# Altium schematic sheet ESP32WROOM_Sheet.SchDoc: ESP32-WROOM-32
size 381 x 241 mm; DocumentNumber: 1; Revision: 1.0; SheetNumber: 1; SheetTotal: 5
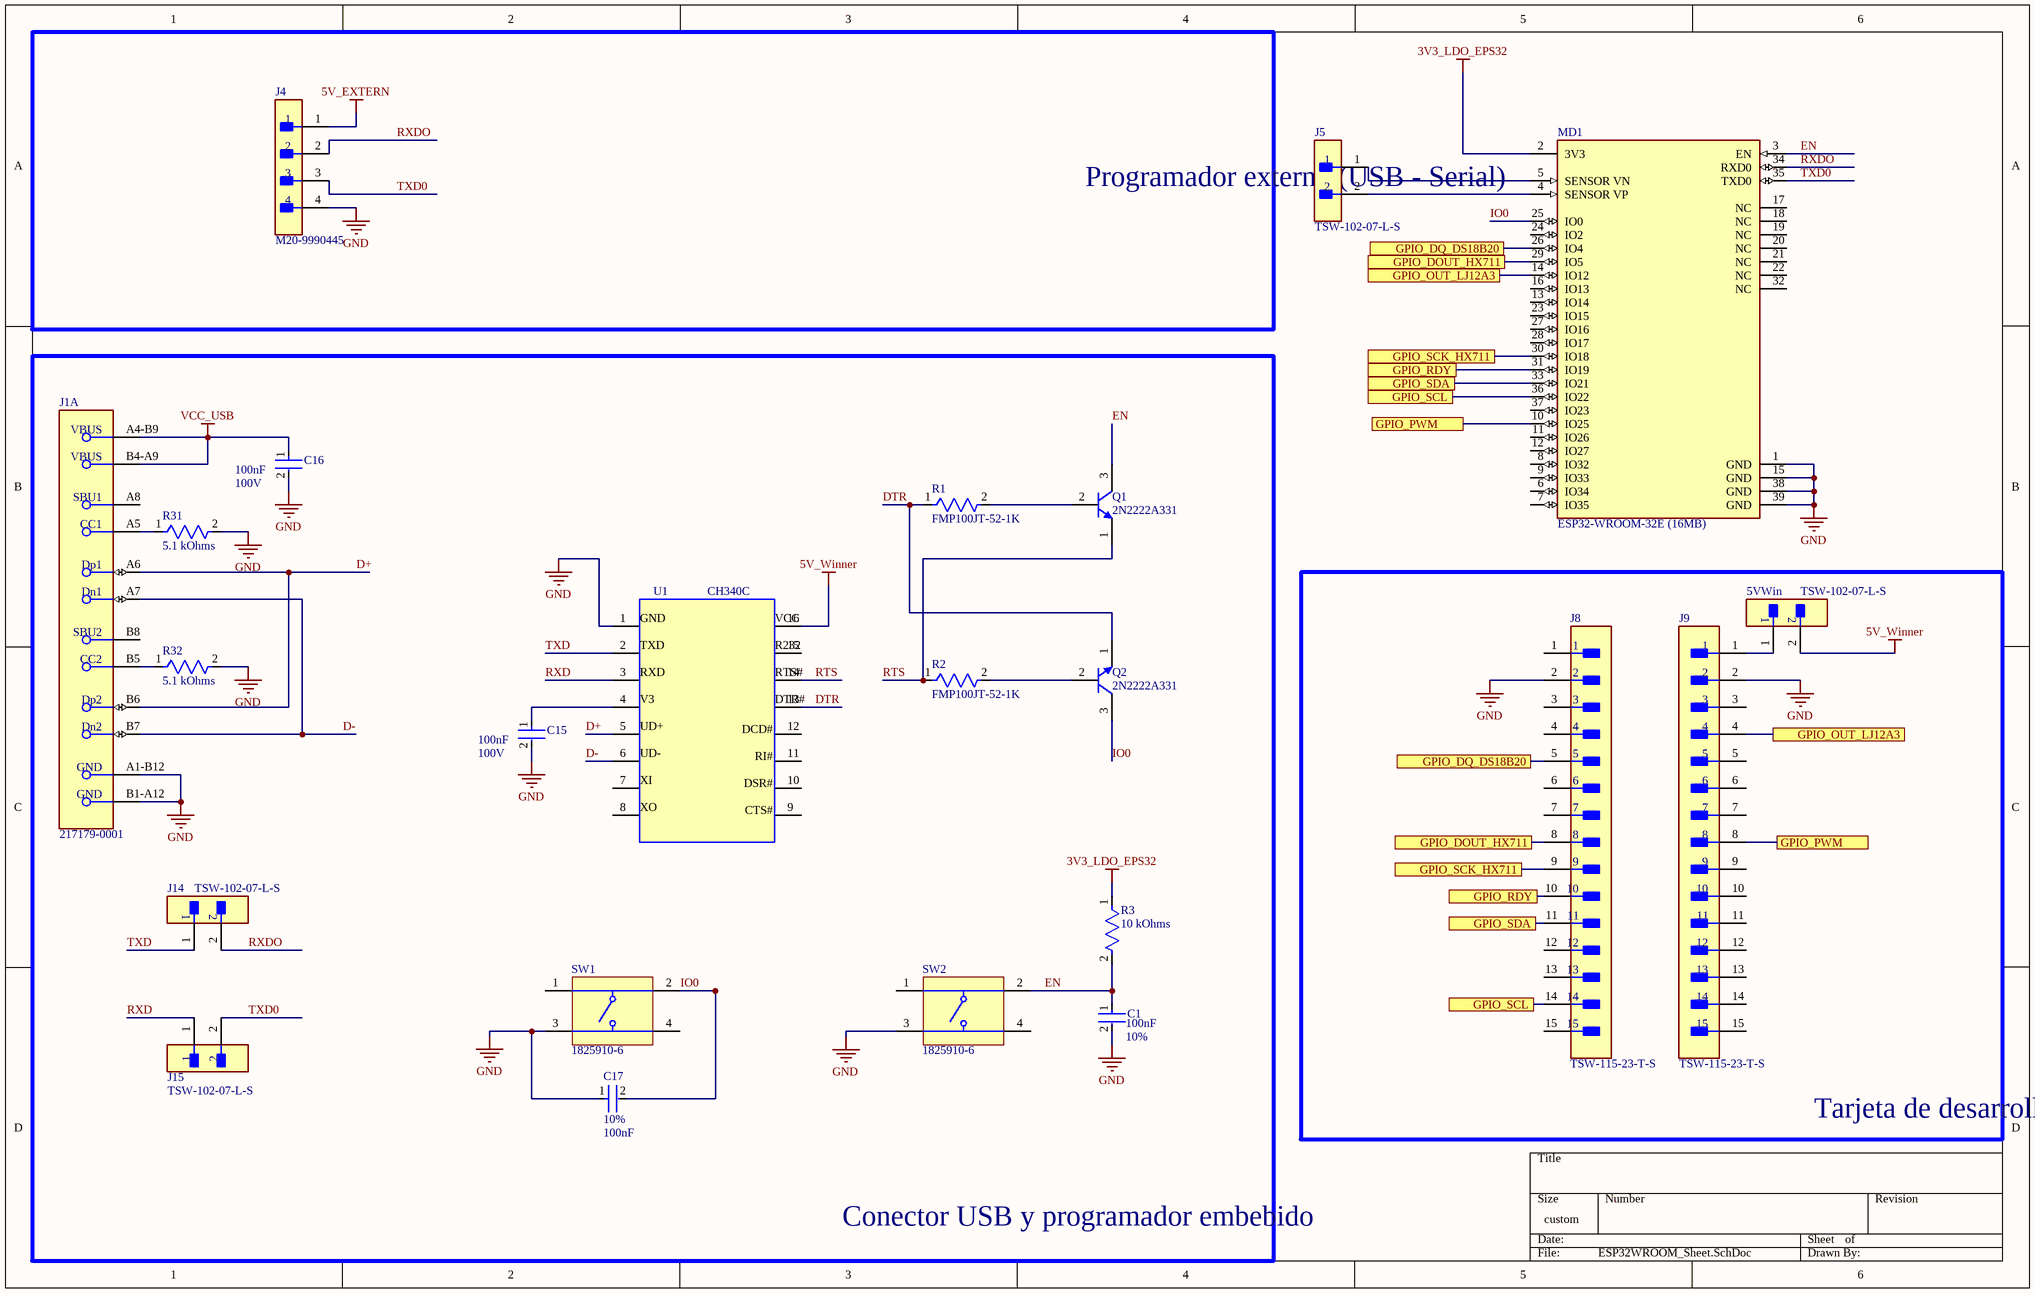
[diagram p0: ESP32WROOM_Sheet.SchDoc]

## Parts
5VWin  TSW-102-07-L-S  [FP-TSW-102-07-L-S-MFG]
C1  Tolerance: 10%  Capacitance: 100nF  [FP-RDE2M1-MFG]  (hidden comment: RDER72E104K2K1H03B)
C15  Capacitance: 100nF  Voltage Rating (DC): 100V  [FP-RCE1K1-2_5-MFG]  (hidden comment: RCER72A104K1K1H03B)
C16  Capacitance: 100nF  Voltage Rating (DC): 100V  [FP-RCE1K1-2_5-MFG]  (hidden comment: RCER72A104K1K1H03B)
C17  Tolerance: 10%  Capacitance: 100nF  [FP-RDE2M1-MFG]  (hidden comment: RDER72E104K2K1H03B)
J1  217179-0001  [FP-2171790001-MFG]  (part A of 2)
J4  M20-9990445  [FP-M20-9990445-MFG]
J5  TSW-102-07-L-S  [FP-TSW-102-07-L-S-MFG]
J8  TSW-115-23-T-S  [FP-TSW-115-23-T-S-MFG]
J9  TSW-115-23-T-S  [FP-TSW-115-23-T-S-MFG]
J14  TSW-102-07-L-S  [FP-TSW-102-07-L-S-MFG]
J15  TSW-102-07-L-S  [FP-TSW-102-07-L-S-MFG]
MD1  ESP32-WROOM-32E (16MB)  [FP-ESP32-WROOM-32E_16MB-MFG]
Q1  2N2222A331  [TO-92]
Q2  2N2222A331  [TO-92]
R1  FMP100JT-52-1K  [FP-FMP100-MFG]
R2  FMP100JT-52-1K  [FP-FMP100-MFG]
R3  10 kOhms  [FP-FMP100-MFG]
R31  5.1 kOhms  [FP-FMP100-MFG]
R32  5.1 kOhms  [FP-FMP100-MFG]
SW1  1825910-6  [TECO-1825910-6_V]
SW2  1825910-6  [TECO-1825910-6_V]
U1  CH340C  [SOP-16 (SOP127P780X190-16N)]

## Blocks framed on the sheet
Programador externo (USB - Serial): J4
Conector USB y programador embebido: C1 C15-C17 J1 J14 J15 Q1 Q2 R1-R3 R31 R32 SW1 SW2 U1
Tarjeta de desarrollo externa: 5VWin J8 J9

## Ports
GPIO_DOUT_HX711 (see ESP32WROOM_Sheet[5A], Sensores_ADCs_Sheet[3C]), GPIO_DOUT_HX711 (see ESP32WROOM_Sheet[5C], Sensores_ADCs_Sheet[3C]), GPIO_DQ_DS18B20 (see ESP32WROOM_Sheet[5A], Sensores_ADCs_Sheet[4B]), GPIO_DQ_DS18B20 (see ESP32WROOM_Sheet[5C], Sensores_ADCs_Sheet[4B]), GPIO_OUT_LJ12A3 (see ESP32WROOM_Sheet[5A], Sensores_ADCs_Sheet[5B]), GPIO_OUT_LJ12A3 (see ESP32WROOM_Sheet[6C], Sensores_ADCs_Sheet[5B]), GPIO_PWM (see Driver_Motor_Sheet[1C], ESP32WROOM_Sheet[5B]), GPIO_PWM (see Driver_Motor_Sheet[1C], ESP32WROOM_Sheet[6C]), GPIO_RDY (see ESP32WROOM_Sheet[5B], Sensores_ADCs_Sheet[4B]), GPIO_RDY (see ESP32WROOM_Sheet[5C], Sensores_ADCs_Sheet[4B]), GPIO_SCK_HX711 (see ESP32WROOM_Sheet[5B], Sensores_ADCs_Sheet[3C]), GPIO_SCK_HX711 (see ESP32WROOM_Sheet[5C], Sensores_ADCs_Sheet[3C]), GPIO_SCL (see ESP32WROOM_Sheet[5B], Sensores_ADCs_Sheet[4A]), GPIO_SCL (see ESP32WROOM_Sheet[5D], Sensores_ADCs_Sheet[4A]), GPIO_SDA (see ESP32WROOM_Sheet[5B], Sensores_ADCs_Sheet[4A]), GPIO_SDA (see ESP32WROOM_Sheet[5C], Sensores_ADCs_Sheet[4A])

## Nets
3V3_LDO_EPS32: MD1.2(3V3) R3.1
5V_EXTERN: J4.1
5V_Winner: 5VWin.2 U1.16
GND: C1.2 C15.2 C16.2 C17.1 J1.A1-B12(GND) J1.B1-A12(GND) J4.4 J8.2 J9.2 MD1.1(GND) MD1.15(GND) MD1.38(GND) MD1.39(GND) R31.2 R32.2 SW1.3 SW2.3 U1.1
VCC_USB: C16.1 J1.A4-B9(VBUS) J1.B4-A9(VBUS)
D+: J1.A6(Dp1) J1.B6(Dp2) U1.5
D-: J1.A7(Dn1) J1.B7(Dn2) U1.6
DTR: Q2.1(E) R1.1 U1.13
EN: C1.1 MD1.3(EN) Q1.3(C) R3.2 SW2.2
GPIO_DOUT_HX711: J8.8 MD1.29(IO5) ; port GPIO_DOUT_HX711
GPIO_DQ_DS18B20: J8.5 MD1.26(IO4) ; port GPIO_DQ_DS18B20
GPIO_OUT_LJ12A3: J9.4 MD1.14(IO12) ; port GPIO_OUT_LJ12A3
GPIO_PWM: J9.8 MD1.10(IO25) ; port GPIO_PWM
GPIO_RDY: J8.10 MD1.31(IO19) ; port GPIO_RDY
GPIO_SCK_HX711: J8.9 MD1.30(IO18) ; port GPIO_SCK_HX711
GPIO_SCL: J8.14 MD1.36(IO22) ; port GPIO_SCL
GPIO_SDA: J8.11 MD1.33(IO21) ; port GPIO_SDA
IO0: C17.2 MD1.25(IO0) Q2.3(C) SW1.2
RTS: Q1.1(E) R2.1 U1.14
RXD: J15.1 U1.3
RXDO: J4.2 J14.2 MD1.34(RXD0)
TXD: J14.1 U1.2
TXD0: J4.3 J15.2 MD1.35(TXD0)
Net5VWin_1: 5VWin.1 J9.1
NetC15_1: C15.1 U1.4
NetJ1_A5: J1.A5(CC1) R31.1
NetJ1_B5: J1.B5(CC2) R32.1
NetJ5_1: J5.1 MD1.5(SENSOR_VN)
NetJ5_2: J5.2 MD1.4(SENSOR_VP)
NetQ1_2: Q1.2(B) R1.2
NetQ2_2: Q2.2(B) R2.2

Not connected (* = marked no-connect by the designer): J1 A8(SBU1) B8(SBU2); J8 1 3 4 6 7 12 13 15; J9 3 5 6 7 9 10 11 12 13 14 15; MD1 6(IO34) 7(IO35) 8(IO32) 9(IO33) 11(IO26) 12(IO27) 13(IO14) 16(IO13) 17(NC) 18(NC) 19(NC) 20(NC) 21(NC) 22(NC) 23(IO15) 24(IO2) 27(IO16) 28(IO17) 32(NC) 37(IO23); SW1 1 4; SW2 1 4; U1 7 8 9 10 11 12 15

## Notes on the sheet
- (in symbol CH340) GND; VCC; TXD; R232; RXD; RTS#; V3; DTR#; DCD#; UD+; RI#; UD-; DSR#; XI; CTS#; XO

## Library data of the parts
5VWin J5 J14 J15 = CMP-02766-001428-1: CONN HEADER VERT 2POS 2.54MM; Voltage Rating: 550V; Current Rating: 7.6A; Gender: Male; Number of Contacts: 2; Connector Type: Male Pin; Radiation Hardening: No; Orientation: Straight; Contact Plating: Gold; Max Operating Temperature: 125°C; Mount: Through Hole; Package Quantity: 1; Number of Rows: 1; Housing Material: Polyester; RoHS Compliant: Yes; Length: 5.08mm; Max Voltage Rating (AC): 550V; Pitch: 2.54mm; Packaging: Bulk; Depth: 2.54mm; Termination: Solder; Min Operating Temperature: -55°C; Housing Color: Black; Lead Free: Lead Free; Color: Black; Number of Positions: 2; Width: 2.54mm; Max Current Rating: 7.6A; REACH SVHC: No SVHC; Contact Material: Bronze; Contact Mating Length: 0.23inch; Series: TSW; Contact Type: Male Pin
C1 C17 = CMP-06035-020184-1: Ceramic Capacitor 100nF ±10% 250V X7R Radial; Lead/Base Style: Kinked; Lead Diameter: 0.5mm; Lead Pitch: 0.197inch; Dielectric: X7R; Mount: Through Hole; Resistor Type: Ceramic; Height: 4mm; Width: 0.124inch; Length: 5.5mm; Case/Package: Radial; Packaging: Bulk; Max Operating Temperature: 125°C; Voltage Rating (DC): 250V; Package Quantity: 500; Min Operating Temperature: -55°C; Voltage Rating: 250V; Termination: Radial; Height - Seated (Max): 0.236inch; Lead Free: Lead Free
C15 C16 = CMP-06035-011084-1: Cap Ceramic Monolithic 100nF 100V 10% Thru-Hole Bulk; Dielectric: X7R; Lead/Base Style: Formed Leads; Lead Diameter: 0.5mm; Resistor Type: Ceramic; Voltage Rating: 100V; Case/Package: Radial; Packaging: Bulk; Lead Pitch: 0.197inch; Height - Seated (Max): 0.138inch; Mount: Through Hole; Height: 3.5mm; Width: 0.098inch; Termination: Radial; Tolerance: 10%; Min Operating Temperature: -55°C; Package Quantity: 500; Max Operating Temperature: 125°C; Length: 0.157inch; Ratings: AEC-Q200
J1 = CMP-04767-000028-2: CONN RCP USB2.0 TYP C 24P SMD RA; NexarPartId: 117190526; Gender: Receptacle; Number of Contacts: 16; Current Rating: 1.25A; Voltage Rating: 30V; Min Operating Temperature: -40°C; USB Standard: USB 2.0; Height: 3.36mm; Contact Material: Gold, Nickel; Max Operating Temperature: 85°C
J4 = CMP-00671-05399696-1: M20-9990445 Conn Unshrouded Header HDR 4 POS 2.54mm Solder ST Thru-Hole Bulk/Loose; Insulation Resistance: 10GΩ; Connector Type: Male Pin; Voltage Rating (DC): 750V; Max Current Rating: 3A; Contact Resistance: 25mΩ; Number of Contacts: 4; Gender: Male; Color: Black; Height: 2.54mm; Contact Material: Brass, Bronze, Gold, Nickel; Orientation: Straight; Width: 12.7mm; Mount: Through Hole; Pitch: 2.54mm; Lead Pitch: 2.54mm; RoHS: Compliant; Max Operating Temperature: 105°C; Case/Package: SIL; NexarPartId: 5399696; Depth: 2.54mm; Length: 10.16mm; Current Rating: 3A; Contact Plating: Gold; Radiation Hardening: No; Contact Mating Length: 6.096mm; Voltage Rating (AC): 750V; Termination: Solder; REACH SVHC: No SVHC; Weight: 45.359237g; Number of Rows: 1; Min Operating Temperature: -40°C; Housing Material: Nylon; Housing Color: Black; Number of Positions: 4; Number of Pins: 4
J8 J9 = CMP-02766-001466-1: CONN HEADER VERT 15POS 2.54MM; Connector Type: Male Pin; Number of Contacts: 15; Gender: Male; Pitch: 0.1inch; Termination: Solder; Packaging: Bulk; Lead Free: Lead Free; Housing Color: Black; Housing Material: Plastic; Color: Black; RoHS Compliant: Yes; Contact Type: Male Pin; Width: 2.54mm; Mount: Through Hole; Contact Material: Bronze; Number of Rows: 1; Radiation Hardening: No; Number of Positions: 15; Length: 38.1mm; REACH SVHC: No SVHC; Height: 2.54mm; Contact Plating: Tin; Series: TSW; Contact Mating Length: 0.23inch
MD1 = CMP-194065-000027-1: RX TXRX MOD WIFI TRACE ANT SMD
Q1 Q2 = 2N2222A331: Bipolar (Bjt) Single Transistor, Npn, 30 V, 500 Mw, 800 Ma, 100 Rohs Compliant: Yes |Multicomp Pro 2N2222; Body Material: Metal; Collector Emitter Breakdown Voltage: 30V; hFE Min: 30; Max Collector Current: 800mA; Max Power Dissipation: 500mW; Number of Elements: 1; Transition Frequency: 250MHz; Supplier: Newark; Supplier Part Number: 87K2254; Manufacturer: Multicomp; Manufacturer Part Number: 2N2222; RoHS: Compliant; Category: BJTs; Stock: 14638; Pricing: 1=0,685, 10=0,562, 50=0,429, 100=0,379, 500=0,361, 1000=0,311, 5000=0,286, 10000=0,274 (USD); Case/Package: TO-18; Collector Emitter Voltage (VCEO): 30V; Lifecycle Status: Production; Max Operating Temperature: 200°C; Pins: 3; Number of Terminals: 3; Polarity: NPN; Power Dissipation: 500mW; REACH SVHC: No; ComponentLink1URL: https://datasheet.octopart.com:443/2N2222-Multicomp-datasheet-632794.pdf?src-supplier=IHS; ComponentLink1Description: https://datasheet.octopart.com:443/2N2222-Multicomp-datasheet-632794.pdf?src-supplier=IHS; ComponentLink2URL: https://datasheet.octopart.com:443/2N2222-Multicomp-datasheet-12475390.pdf?src-supplier=Newark; ComponentLink2Description: https://datasheet.octopart.com:443/2N2222-Multicomp-datasheet-12475390.pdf?src-supplier=Newark
R1-R3 R31 R32 = CMP-00621-25629781-1: Resistor, 1 kOhm, ± 5%, 1 W, Axial Leaded, Metal Film, High Power Flame Proof; Power Rating: 1W; Resistance: 1kΩ; Temperature Coefficient: 100ppm/°C; Length: 6.3mm; Min Operating Temperature: -55°C; Tolerance: 5%; RoHS: Compliant; Military Standard: Not; Mount: Through Hole; Case/Package: Conformal; Diameter: 2.4mm; Schedule B: 8533210090, 8533210090; Radiation Hardening: No; Lead Free: Lead Free; Composition: Metal Film; Max Operating Temperature: 155°C; Termination: Axial
SW1 SW2 = CMP-1684-00021-1: Tact Switch, SPST-NO, 0.05 A, -35 to 85 degC, 4-Pin THD, RoHS, Bulk; Manufacturer: TE Connectivity; Maximum Contact Resistance: 100mOhm; Mechanical Life: 100000Cycles; Bushing Type: Unthreaded; Switch Configuration: OFF(ON); Maximum DC Voltage Rating: 24V; Contact Rating @ Voltage: 0.05A@24VDC; Actuator Color: Black; Body Orientation: Straight; Function: MomentaryContact; Illumination: N/R; Actuator Style: RoundButton; Actuator Material: PolybutyleneTerephthalate; Dielectric Strength: 500VAC; Pole Throw Configuration: SPST; Actuator Length: 1.4mm; Product Weight: N/A; Contact Material: CopperAlloy; Housing Material: N/A; Terminal Type: PCPins; Minimum Insulation Resistance: 100MOhm; Package Description: 4-Pin Through Hole Device, Body 5.99 x 5.99 mm, Pitch 6.5 mm; Part No: 1825910-6; Package Reference: THD; Base Material: N/A; Manufacturer URL: http://www.te.com; Contact Plating: Silver; RoHS: Yes; Datasheet Version: Rev. C9; Electrical Life: 100000Cycles; Maximum AC Voltage Rating: N/A; Thread Size: N/R; Operating Temperature: -35to85C; Mounting: ThroughHole; Dimension: 5.99x5mm; Datasheet URL: http://www.te.com/commerce/DocumentDelivery/DDEController?Action=showdoc&DocId=Customer+Drawing%7F1825910%7FC9%7Fpdf%7FEnglish%7FENG_CD_1825910_C9.pdf%7F1825910-6; Family: 1825910; Seal Location: N/A; Seal Description: N/A; Packaging: N/A
U1 = CH340: Supply rail voltage, reference to GND pin: -0.5 - 6.5 V; IO pin voltage, reference to GND pin: -0.5 - VCC+0.5 V; Supply rail voltage (5V operation): 4.5 - 5.5 V; Supply rail voltage (3V operation): 3.3 - 3.8 V; Operating current: 12 - 30 mA; Sleeping current (5V operation): 150 - 200 uA; Sleeping current (3V operation): 50 - 80 uA; Low input voltage: -0.5 - 0.7 V; High input voltage: 2.0 - VCC+0.5 V; Low output voltage: 0.5 V; High output voltage: VCC-0.5 V; Internal pull-up strength: 3 - 300 (typ 150) µA; Internal pull-down strength: -50 - -300 (typ -150) µA; Brown-out detector threshold voltage: 2.3 - 2.9 (typ 2.6) V; Clock frequency (at pin XI): 11.98 - 12.02 (typ 12.00) MHz; Power-on reset time: 20 - 50 ms; Operating temperature: -40 - 85 ºC; Storage temperature: -40 - 125 ºC; ComponentLink1Description: datasheet; ComponentLink1URL: https://www.mouser.com/datasheet/2/306/CH340DS1-2487512.pdf?srsltid=AfmBOooaCm0bY9ghGhDfZzr0yr_8N53BDd8jqQWjHYTFMZadGDepO_U8; ComponentLink2Description: Sparkfun module; ComponentLink2URL: https://co.mouser.com/ProductDetail/SparkFun/DEV-15096?qs=l7cgNqFNU1ix43QyKol73A%3D%3D